# EAGLE design PCB-E21-KP01 (EAGLE 7.5.0)

## Sheet 1 of 2
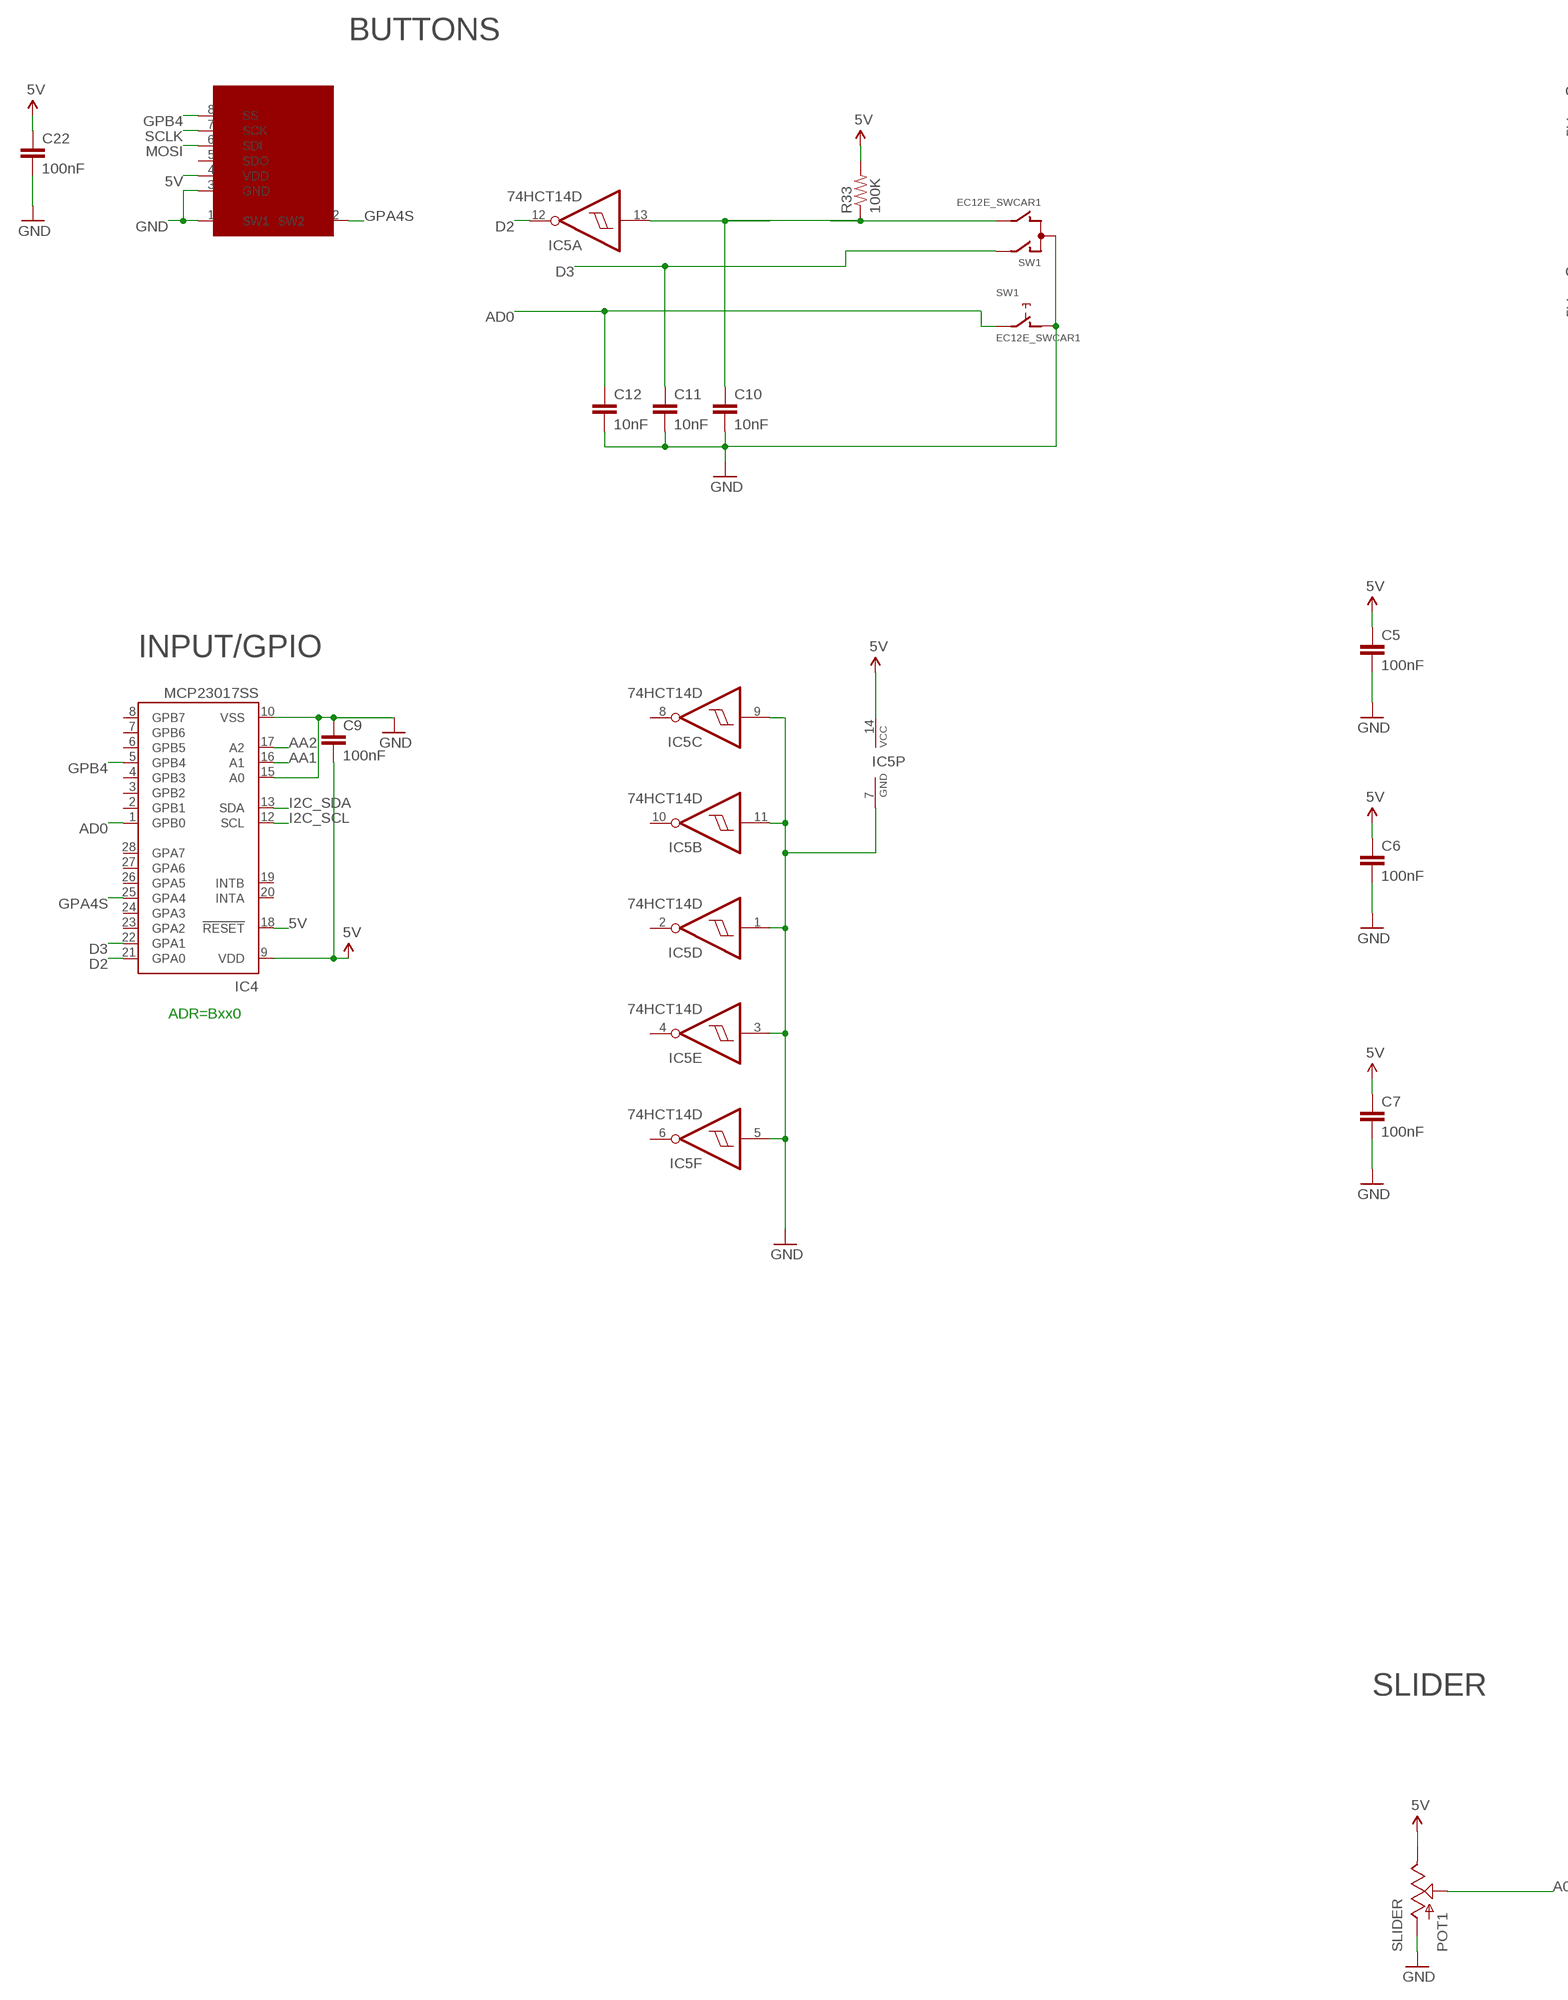
[diagram p0: schematic, sheet 1, part 1 of 2]
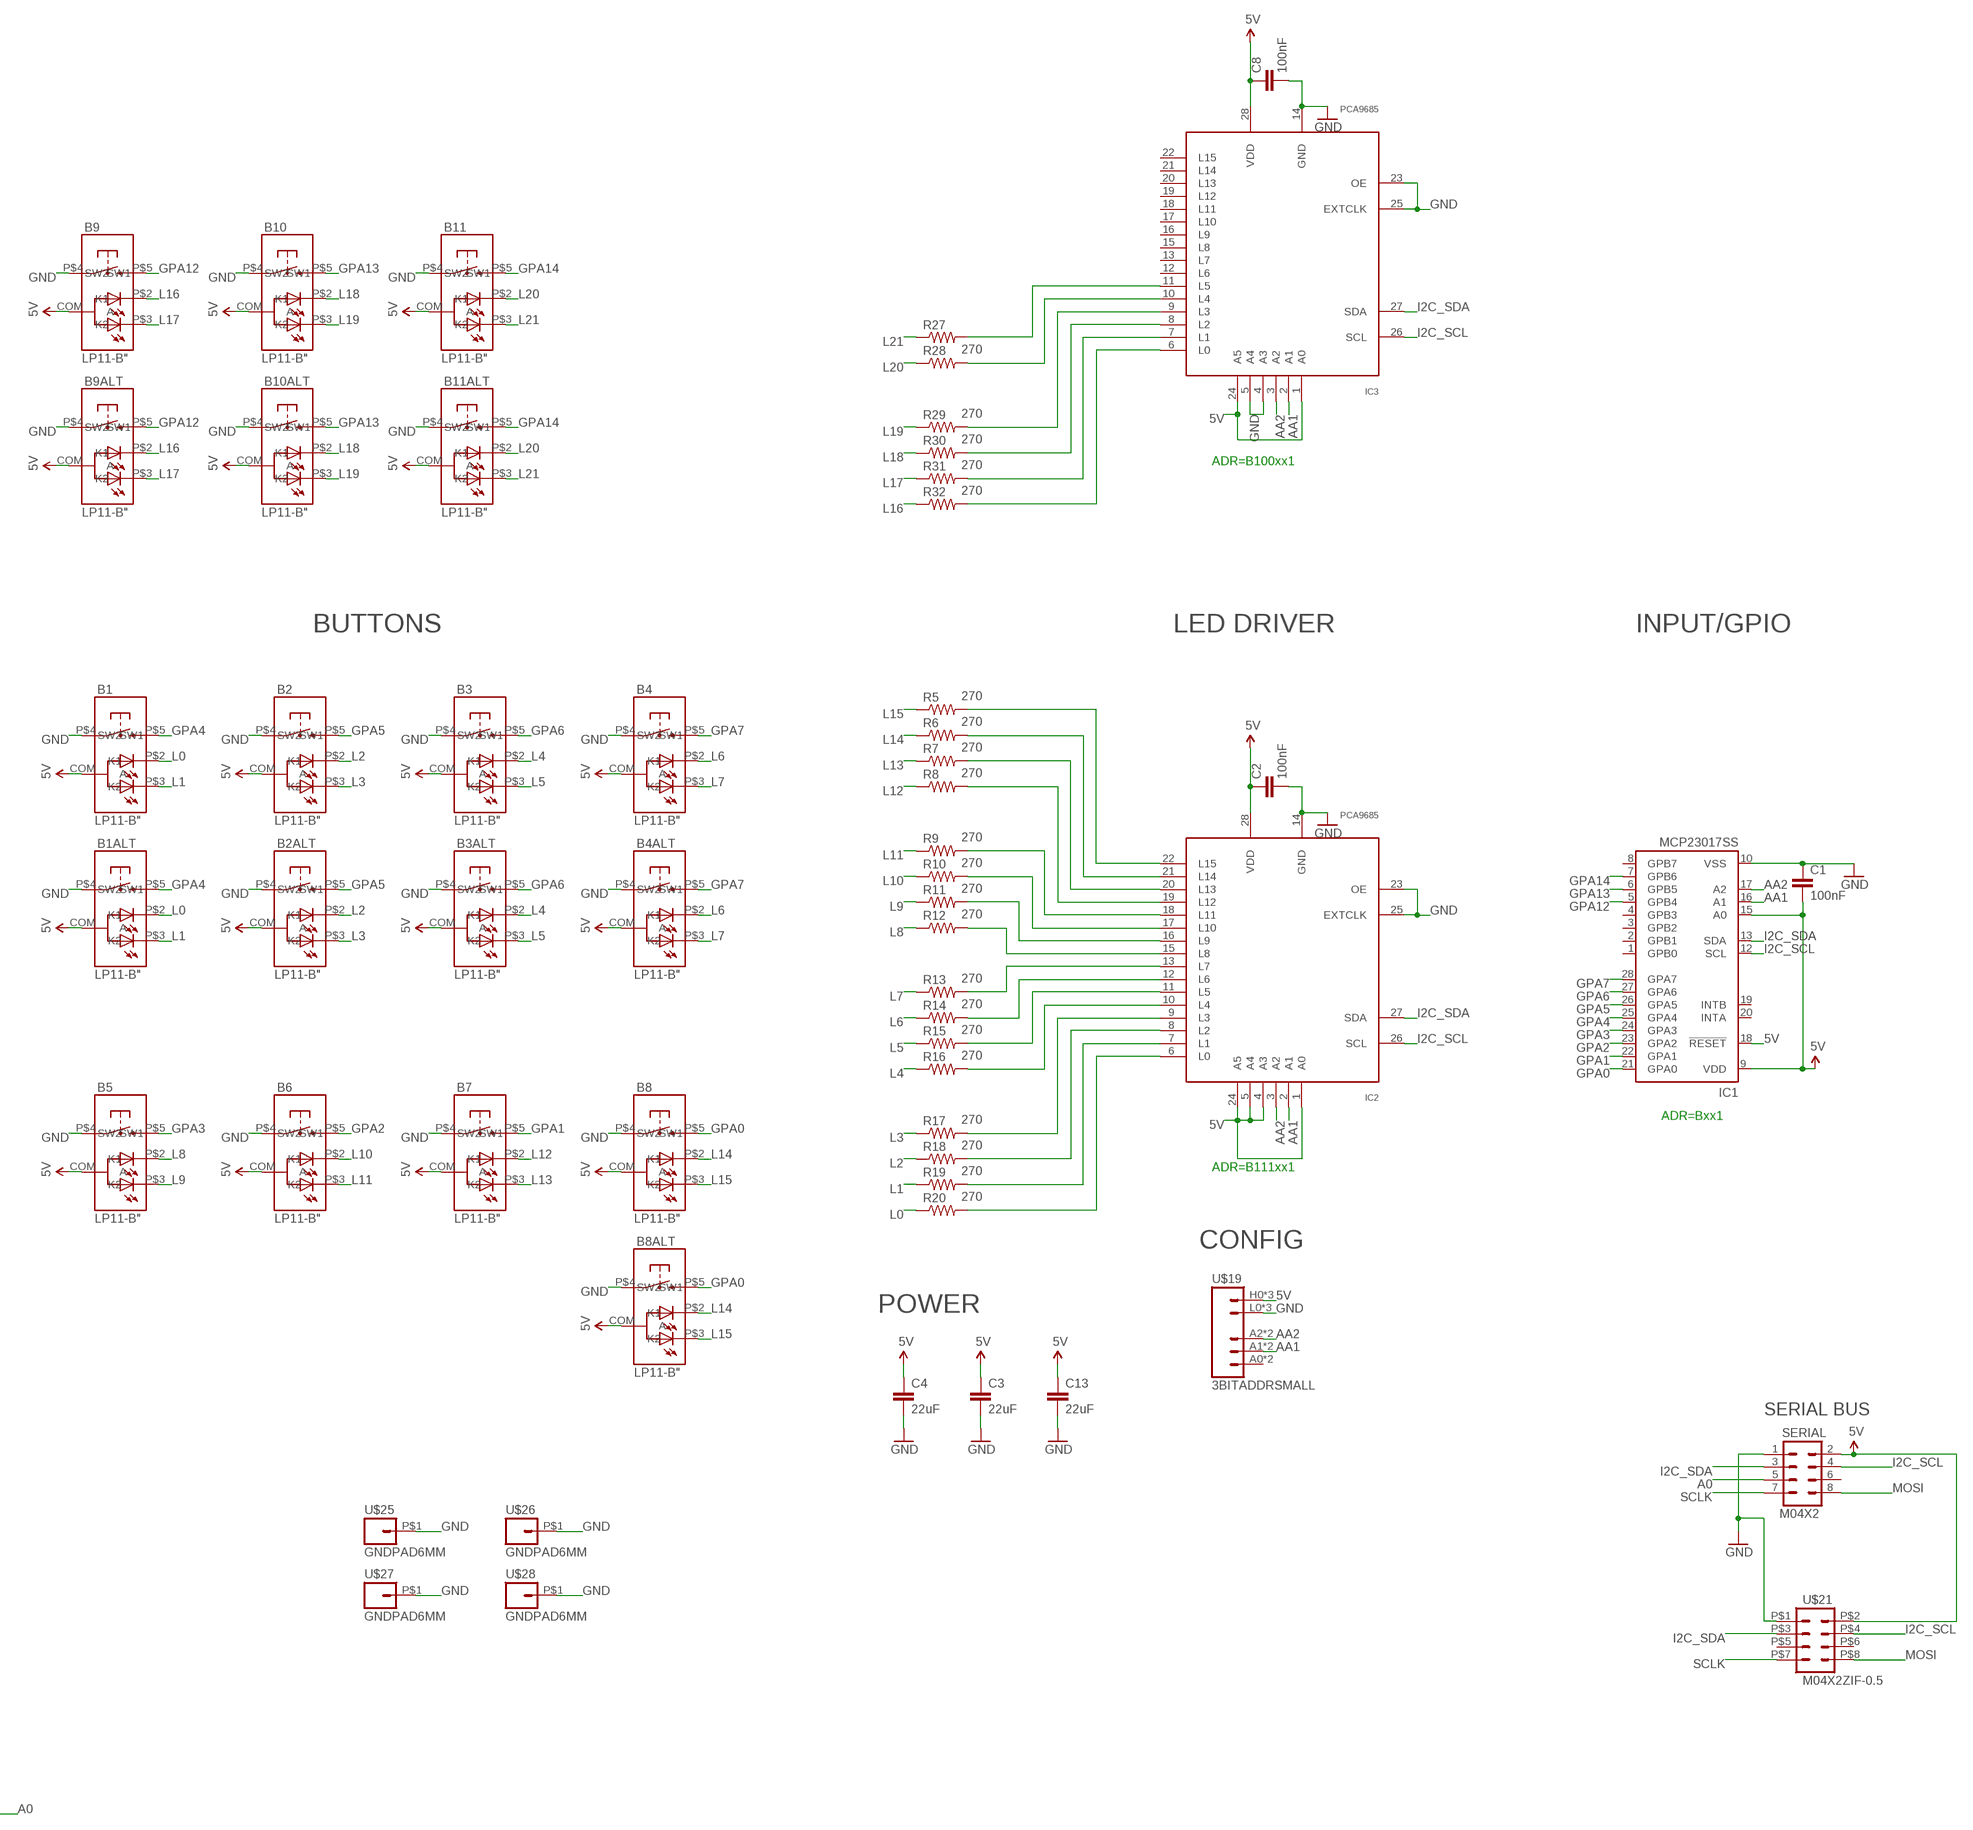
[diagram p1: schematic, sheet 1, part 2 of 2]

### Parts
B1  LP11-B"  [LP11]
B1ALT  LP11-B"  [LP11]
B2  LP11-B"  [LP11]
B2ALT  LP11-B"  [LP11]
B3  LP11-B"  [LP11]
B3ALT  LP11-B"  [LP11]
B4  LP11-B"  [LP11]
B4ALT  LP11-B"  [LP11]
B5  LP11-B"  [LP11]
B6  LP11-B"  [LP11]
B7  LP11-B"  [LP11]
B8  LP11-B"  [LP11]
B8ALT  LP11-B"  [LP11]
B9  LP11-B"  [LP11]
B9ALT  LP11-B"  [LP11]
B10  LP11-B"  [LP11]
B10ALT  LP11-B"  [LP11]
B11  LP11-B"  [LP11]
B11ALT  LP11-B"  [LP11]
C1  100nF  CAP0603-CAP  [0603-CAP]
C2  100nF  CAP0603-CAP  [0603-CAP]
C3  22uF  CAP0805  [0805]
C4  22uF  CAP0805  [0805]
C5  100nF  CAP0603-CAP  [0603-CAP]
C6  100nF  CAP0603-CAP  [0603-CAP]
C7  100nF  CAP0603-CAP  [0603-CAP]
C8  100nF  CAP0603-CAP  [0603-CAP]
C9  100nF  CAP0603-CAP  [0603-CAP]
C10  10nF  CAP0603-CAP  [0603-CAP]
C11  10nF  CAP0603-CAP  [0603-CAP]
C12  10nF  CAP0603-CAP  [0603-CAP]
C13  22uF  CAP0805  [0805]
C22  100nF  CAP0603-CAP  [0603-CAP]
IC1  MCP23017SS  [SSOP28]
IC2  PCA9685  [TSSOP28]
IC3  PCA9685  [TSSOP28]
IC4  MCP23017SS  [SSOP28]
IC5  74HCT14D  [SO14]
POT1  SLIDER  [SLIDER20-CAR1]
R5  270  RESISTOR0603-RES  [0603-RES]
R6  270  RESISTOR0603-RES  [0603-RES]
R7  270  RESISTOR0603-RES  [0603-RES]
R8  270  RESISTOR0603-RES  [0603-RES]
R9  270  RESISTOR0603-RES  [0603-RES]
R10  270  RESISTOR0603-RES  [0603-RES]
R11  270  RESISTOR0603-RES  [0603-RES]
R12  270  RESISTOR0603-RES  [0603-RES]
R13  270  RESISTOR0603-RES  [0603-RES]
R14  270  RESISTOR0603-RES  [0603-RES]
R15  270  RESISTOR0603-RES  [0603-RES]
R16  270  RESISTOR0603-RES  [0603-RES]
R17  270  RESISTOR0603-RES  [0603-RES]
R18  270  RESISTOR0603-RES  [0603-RES]
R19  270  RESISTOR0603-RES  [0603-RES]
R20  270  RESISTOR0603-RES  [0603-RES]
R27  270  RESISTOR0603-RES  [0603-RES]
R28  270  RESISTOR0603-RES  [0603-RES]
R29  270  RESISTOR0603-RES  [0603-RES]
R30  270  RESISTOR0603-RES  [0603-RES]
R31  270  RESISTOR0603-RES  [0603-RES]
R32  270  RESISTOR0603-RES  [0603-RES]
R33  100K  RESISTOR0603-RES  [0603-RES]
SERIAL  M04X2  [2X4]
SSW1  SMART_SWITCHSMART_SWITCH_8PIN  [SMART_SWITCH]
SW1  EC12E_SWCAR1  [ALPS_EC12E_SW-CAR1]
U$19  3BITADDRSMALL  [3BITADDR_SMALL]
U$21  M04X2ZIF-0.5  [ZIP-8-0.5]
U$25  GNDPAD6MM  [3.2MMPAD6MM]
U$26  GNDPAD6MM  [3.2MMPAD6MM]
U$27  GNDPAD6MM  [3.2MMPAD6MM]
U$28  GNDPAD6MM  [3.2MMPAD6MM]

### Nets
5V [Power]: B1.COM(A) B1ALT.COM(A) B2.COM(A) B2ALT.COM(A) B3.COM(A) B3ALT.COM(A) B4.COM(A) B4ALT.COM(A) B5.COM(A) B6.COM(A) B7.COM(A) B8.COM(A) B8ALT.COM(A) B9.COM(A) B9ALT.COM(A) B10.COM(A) B10ALT.COM(A) B11.COM(A) B11ALT.COM(A) C1.2 C2.1 C3.1 C4.1 C5.1 C6.1 C7.1 C8.1 C9.2 C13.1 C22.1 IC1.9(VDD) IC1.15(A0) IC1.18(!RESET) IC2.1(A0) IC2.4(A3) IC2.5(A4) IC2.24(A5) IC2.28(VDD) IC3.1(A0) IC3.24(A5) IC3.28(VDD) IC4.9(VDD) IC4.18(!RESET) IC5.14(P:VCC) POT1.1(E) R33.2 SERIAL.2 SSW1.4(VDD) U$19.H0(VCC) U$19.H1(VCC) U$19.H2(VCC) U$21.P$2
A0: POT1.2A(S) SERIAL.5
AA1: IC1.16(A1) IC2.2(A1) IC3.2(A1) IC4.16(A1) U$19.A1 U$19.AS1(A1)
AA2: IC1.17(A2) IC2.3(A2) IC3.3(A2) IC4.17(A2) U$19.A2 U$19.AS2(A2)
AD0: C12.1 IC4.1(GPB0) SW1.E
D2: IC4.21(GPA0) IC5.12(A:O)
D3: C11.1 IC4.22(GPA1) SW1.A
GND [Power]: B1.P$4(SW1) B1ALT.P$4(SW1) B2.P$4(SW1) B2ALT.P$4(SW1) B3.P$4(SW1) B3ALT.P$4(SW1) B4.P$4(SW1) B4ALT.P$4(SW1) B5.P$4(SW1) B6.P$4(SW1) B7.P$4(SW1) B8.P$4(SW1) B8ALT.P$4(SW1) B9.P$4(SW1) B9ALT.P$4(SW1) B10.P$4(SW1) B10ALT.P$4(SW1) B11.P$4(SW1) B11ALT.P$4(SW1) C1.1 C2.2 C3.2 C4.2 C5.2 C6.2 C7.2 C8.2 C9.1 C10.2 C11.2 C12.2 C13.2 C22.2 IC1.10(VSS) IC2.14(GND) IC2.23(OE) IC2.25(EXTCLK) IC3.4(A3) IC3.5(A4) IC3.14(GND) IC3.23(OE) IC3.25(EXTCLK) IC4.10(VSS) IC4.15(A0) IC5.1(D:I) IC5.3(E:I) IC5.5(F:I) IC5.7(P:GND) IC5.9(C:I) IC5.11(B:I) POT1.3(A) SERIAL.1 SSW1.1(SW1) SSW1.3(GND) SW1.C SW1.D U$19.L0(GND) U$19.L1(GND) U$19.L2(GND) U$21.P$1 U$25.P$1 U$26.P$1 U$27.P$1 U$28.P$1
GPA0: B8.P$5(SW2) B8ALT.P$5(SW2) IC1.21(GPA0)
GPA1: B7.P$5(SW2) IC1.22(GPA1)
GPA2: B6.P$5(SW2) IC1.23(GPA2)
GPA3: B5.P$5(SW2) IC1.24(GPA3)
GPA4: B1.P$5(SW2) B1ALT.P$5(SW2) IC1.25(GPA4)
GPA4S: IC4.25(GPA4) SSW1.2(SW2)
GPA5: B2.P$5(SW2) B2ALT.P$5(SW2) IC1.26(GPA5)
GPA6: B3.P$5(SW2) B3ALT.P$5(SW2) IC1.27(GPA6)
GPA7: B4.P$5(SW2) B4ALT.P$5(SW2) IC1.28(GPA7)
GPA12: B9.P$5(SW2) B9ALT.P$5(SW2) IC1.5(GPB4)
GPA13: B10.P$5(SW2) B10ALT.P$5(SW2) IC1.6(GPB5)
GPA14: B11.P$5(SW2) B11ALT.P$5(SW2) IC1.7(GPB6)
GPB4: IC4.5(GPB4) SSW1.8(SS)
I2C_SCL: IC1.12(SCL) IC2.26(SCL) IC3.26(SCL) IC4.12(SCL) SERIAL.4 U$21.P$4
I2C_SDA: IC1.13(SDA) IC2.27(SDA) IC3.27(SDA) IC4.13(SDA) SERIAL.3 U$21.P$3
L0: B1.P$2(K1) B1ALT.P$2(K1) R20.1
L1: B1.P$3(K2) B1ALT.P$3(K2) R19.1
L2: B2.P$2(K1) B2ALT.P$2(K1) R18.1
L3: B2.P$3(K2) B2ALT.P$3(K2) R17.1
L4: B3.P$2(K1) B3ALT.P$2(K1) R16.1
L5: B3.P$3(K2) B3ALT.P$3(K2) R15.1
L6: B4.P$2(K1) B4ALT.P$2(K1) R14.1
L7: B4.P$3(K2) B4ALT.P$3(K2) R13.1
L8: B5.P$2(K1) R12.1
L9: B5.P$3(K2) R11.1
L10: B6.P$2(K1) R10.1
L11: B6.P$3(K2) R9.1
L12: B7.P$2(K1) R8.1
L13: B7.P$3(K2) R7.1
L14: B8.P$2(K1) B8ALT.P$2(K1) R6.1
L15: B8.P$3(K2) B8ALT.P$3(K2) R5.1
L16: B9.P$2(K1) B9ALT.P$2(K1) R32.1
L17: B9.P$3(K2) B9ALT.P$3(K2) R31.1
L18: B10.P$2(K1) B10ALT.P$2(K1) R30.1
L19: B10.P$3(K2) B10ALT.P$3(K2) R29.1
L20: B11.P$2(K1) B11ALT.P$2(K1) R28.1
L21: B11.P$3(K2) B11ALT.P$3(K2) R27.1
MOSI: SERIAL.8 SSW1.6(SDI) U$21.P$8
N$3: IC3.11(L5) R27.2
N$4: IC2.13(L7) R13.2
N$5: IC2.12(L6) R14.2
N$6: IC3.10(L4) R28.2
N$7: IC2.11(L5) R15.2
N$8: IC3.9(L3) R29.2
N$9: IC2.10(L4) R16.2
N$10: IC2.9(L3) R17.2
N$11: IC2.8(L2) R18.2
N$12: IC2.7(L1) R19.2
N$13: IC3.8(L2) R30.2
N$14: IC3.7(L1) R31.2
N$15: IC3.6(L0) R32.2
N$19: IC2.6(L0) R20.2
N$20: IC2.15(L8) R12.2
N$21: IC2.16(L9) R11.2
N$22: IC2.17(L10) R10.2
N$23: IC2.18(L11) R9.2
N$24: IC2.19(L12) R8.2
N$25: IC2.20(L13) R7.2
N$26: IC2.21(L14) R6.2
N$27: IC2.22(L15) R5.2
N$33: C10.1 IC5.13(A:I) R33.1 SW1.B
SCLK: SERIAL.7 SSW1.7(SCK) U$21.P$7
Unconnected: IC1.1(GPB0) IC1.2(GPB1) IC1.3(GPB2) IC1.4(GPB3) IC1.8(GPB7) IC1.19(INTB) IC1.20(INTA) IC3.12(L6) IC3.13(L7) IC3.15(L8) IC3.16(L9) IC3.17(L10) IC3.18(L11) IC3.19(L12) IC3.20(L13) IC3.21(L14) IC3.22(L15) IC4.2(GPB1) IC4.3(GPB2) IC4.4(GPB3) IC4.6(GPB5) IC4.7(GPB6) IC4.8(GPB7) IC4.19(INTB) IC4.20(INTA) IC4.23(GPA2) IC4.24(GPA3) IC4.26(GPA5) IC4.27(GPA6) IC4.28(GPA7) IC5.2(D:O) IC5.4(E:O) IC5.6(F:O) IC5.8(C:O) IC5.10(B:O) SERIAL.6 SSW1.5(SDO) SW1.GND1(G) SW1.GND2(G) U$19.A0 U$19.AS0(A0) U$21.P$5 U$21.P$6

### Notes on the sheet
- BUTTONS
- ADR=B100xx1
- BUTTONS | LED DRIVER | INPUT/GPIO
- INPUT/GPIO
- ADR=Bxx0
- ADR=Bxx1
- ADR=B111xx1
- CONFIG
- POWER
- SERIAL BUS
- SLIDER

## Sheet 2 of 2

## Library data of the parts
B1 B1ALT B2 B2ALT B3 B3ALT B4 B4ALT B5-B8 B8ALT B9 B9ALT B10 B10ALT B11 B11ALT = SKAARHOJ:LP11-B
C1-C13 C22 = SparkFun:CAP: Capacitor Standard 0603 ceramic capacitor, and 0.1" leaded capacitor.
IC1 IC4 = microchip:MCP23017: http://ww1.microchip.com/downloads/en/DeviceDoc/21952a.pdf Source: http://ww1.microchip.com/downloads/en/DeviceDoc/21952a.pdf; MF: MICROCHIP; MPN: MCP23017-E/SS; OC_FARNELL: 1467674; OC_NEWARK: 31K2960
IC2 IC3 = wsmith:PCA9685
IC5 = 74xx-eu:74*14: Hex schmitt trigger INVERTER
POT1 = SKAARHOJ:SLIDER
R5-R20 R27-R33 = SparkFun:RESISTOR: Resistor Basic schematic elements and footprints for 0603, 1206, and PTH resistors.
SERIAL = SparkFun:M04X2
SSW1 = SKAARHOJ:SMART_SWITCH: SMARTSWITCH IS15DSBFP4RGB www.nkksmartswitch.com
SW1 = SKAARHOJ:EC12E_SW: ALPS rotary Encoder EC12E series with switch
U$19 = SKAARHOJ:3BITADDR
U$21 = SKAARHOJ:M04X2
U$25-U$28 = SKAARHOJ:GNDPAD

## Net classes
0 default: width 0.203 mm, drill 0.406 mm, clearance 0.203 mm
1 Power: width 0.406 mm, drill 0.61 mm, clearance 0.203 mm

## Board
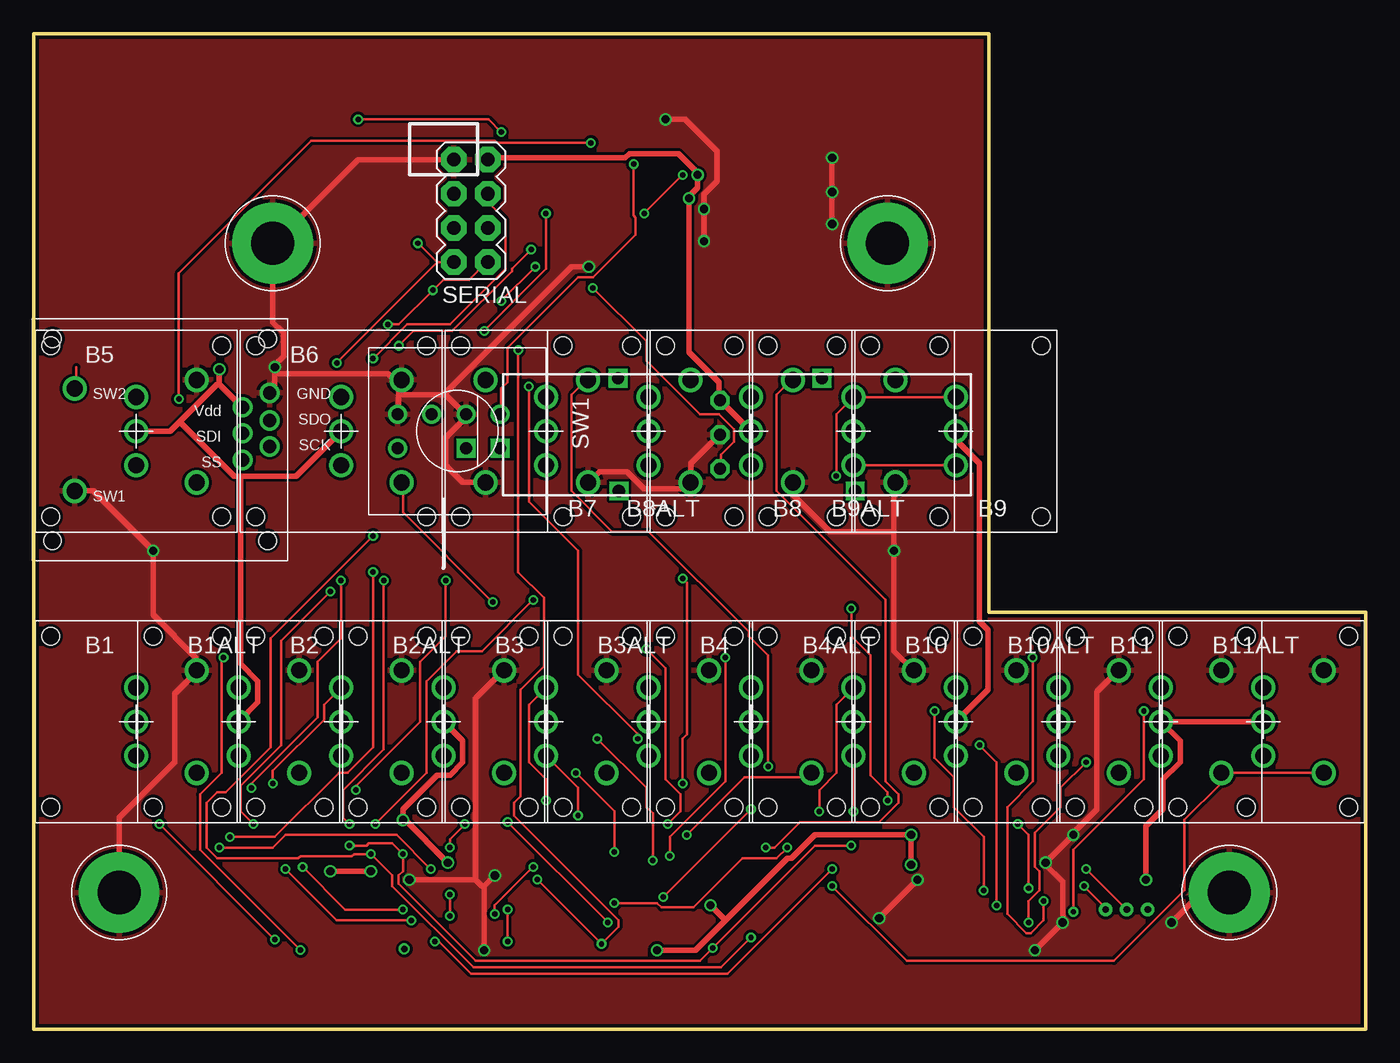
[diagram p2: board, top side]
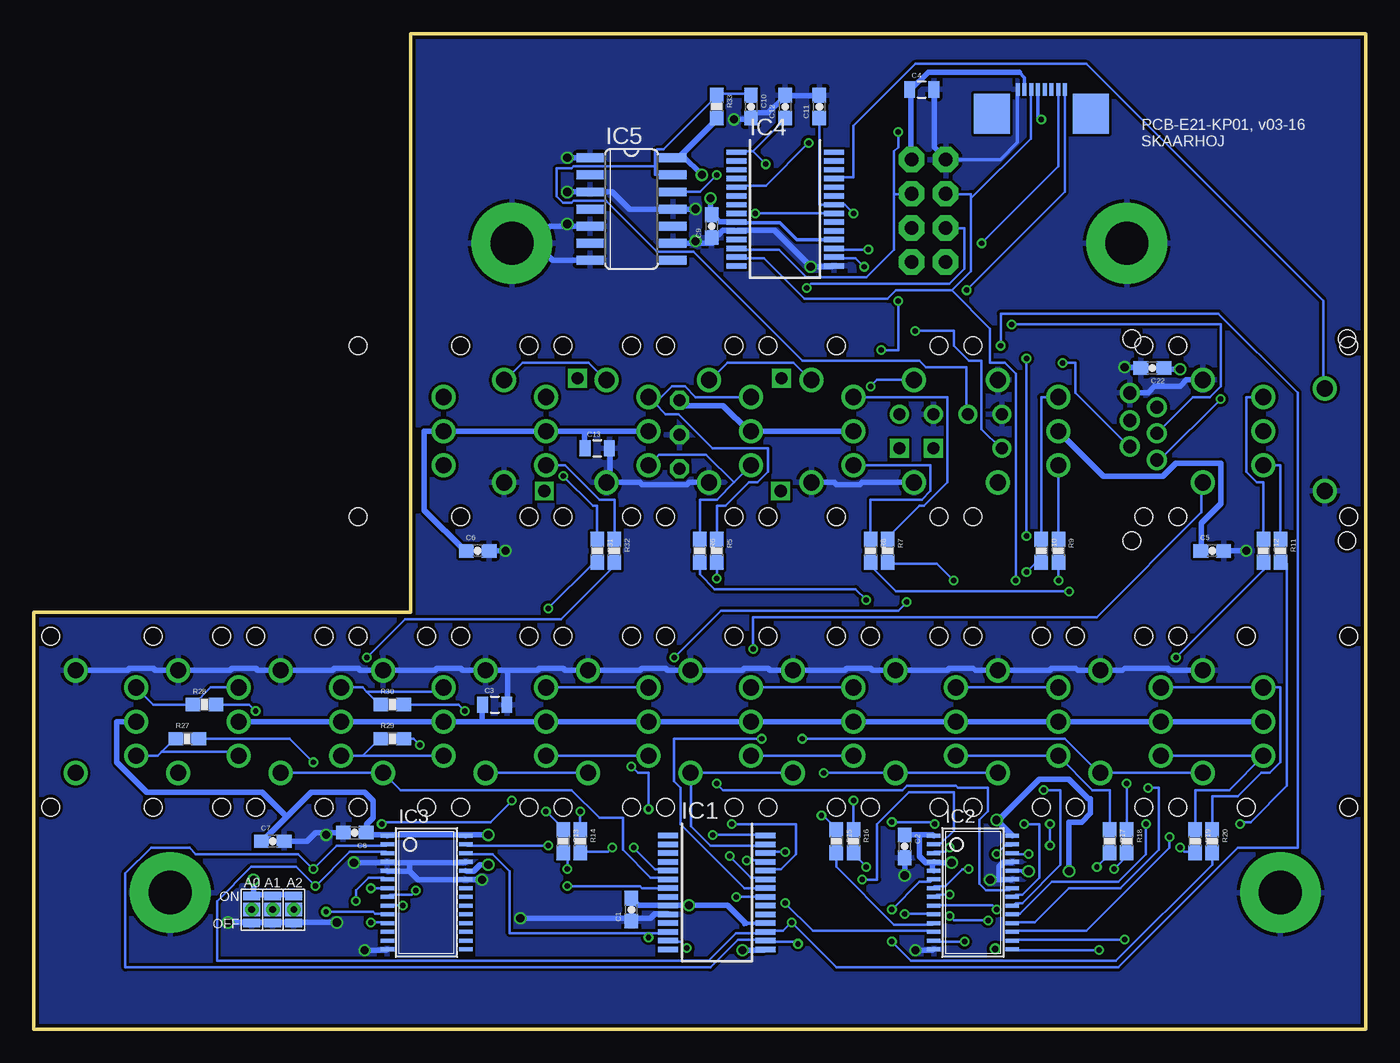
[diagram p3: board, bottom side, seen from below]

Size 99.06 x 74 mm. Coordinates in mm from the lower left corner, seen from the top.
Outline: 0,74 0,0 99.06,0 99.06,31 71.03,31 71.03,74 0,74
Copper layers (1*16): Top 0.035mm / dielectric 1.5mm / Bottom 0.035mm
Design rules "Fusion_eagle_rule_v1.1": minimum track width 6mil, minimum drill 12mil, track to track 6mil, track to pad 6mil, pad to pad 6mil, via to via 6mil, smd to smd 0mil, copper to edge 10mil, drill to drill 10mil, minimum pad ring 10mil, minimum via ring 6mil, stop-mask expansion 2mil, vias tented up to drill 100mil, thermal gap 10mil

### Footprints (pad centres in the part's own frame; a part is rotated, then mirrored left to right if it is on the bottom)
LP11 = drill 1.2: COM 0,0; P$2 0,2.54; P$3 0,-2.54; P$4 4.5,3.81; P$5 4.5,-3.81 | hole 1.3: -6.35,6.35; 6.35,6.35; 6.35,-6.35; -6.35,-6.35
0603-CAP = smd 1.1 x 1: 1 -0.85,0; 2 0.85,0
0805 = smd 0.8 x 1.2: 1 -0.9,0; 2 0.9,0
SSOP28 = smd 0.4 x 1.5: 1 -4.225,-3.625; 2 -3.575,-3.625; 3 -2.925,-3.625; 4 -2.275,-3.625; 5 -1.625,-3.625; 6 -0.975,-3.625; 7 -0.325,-3.625; 8 0.325,-3.625; 9 0.975,-3.625; 10 1.625,-3.625; 11 2.275,-3.625; 12 2.925,-3.625; 13 3.575,-3.625; 14 4.225,-3.625; 15 4.225,3.625; 16 3.575,3.625; 17 2.925,3.625; 18 2.275,3.625; 19 1.625,3.625; 20 0.975,3.625; 21 0.325,3.625; 22 -0.325,3.625; 23 -0.975,3.625; 24 -1.625,3.625; 25 -2.275,3.625; 26 -2.925,3.625; 27 -3.575,3.625; 28 -4.225,3.625
TSSOP28 = smd 0.305 x 0.991: 1 -4.225,-2.918; 2 -3.575,-2.918; 3 -2.925,-2.918; 4 -2.275,-2.918; 5 -1.625,-2.918; 6 -0.975,-2.918; 7 -0.325,-2.918; 8 0.325,-2.918; 9 0.975,-2.918; 10 1.625,-2.918; 11 2.275,-2.918; 12 2.925,-2.918; 13 3.575,-2.918; 14 4.225,-2.918; 15 4.225,2.918; 16 3.575,2.918; 17 2.925,2.918; 18 2.275,2.918; 19 1.625,2.918; 20 0.975,2.918; 21 0.325,2.918; 22 -0.325,2.918; 23 -0.975,2.918; 24 -1.625,2.918; 25 -2.275,2.918; 26 -2.925,2.918; 27 -3.575,2.918; 28 -4.225,2.918
SO14 = smd 0.66 x 2.032: 1 -3.81,-3.073; 2 -2.54,-3.073; 3 -1.27,-3.073; 4 0,-3.073; 5 1.27,-3.073; 6 2.54,-3.073; 7 3.81,-3.073; 8 3.81,3.073; 9 2.54,3.073; 10 1.27,3.073; 11 0,3.073; 12 -1.27,3.073; 13 -2.54,3.073; 14 -3.81,3.073
SLIDER20-CAR1 = drill 0.9 octagon: 1 -1.27,2.54; 2A -1.27,-2.54; 3 -1.27,0 | drill 0.9 square: P$1 -8.852,4.191; P$2 6.312,4.191; P$3 8.788,-4.191; P$4 -8.788,-4.191
0603-RES = smd 1.1 x 1: 1 -0.85,0; 2 0.85,0
2X4 = drill 1.016 pad 1.88 octagon: 1 -3.81,-1.27; 2 -3.81,1.27; 3 -1.27,-1.27; 4 -1.27,1.27; 5 1.27,-1.27; 6 1.27,1.27; 7 3.81,-1.27; 8 3.81,1.27
SMART_SWITCH = drill 1.2: 1 6.35,3.81; 2 6.35,-3.81 | drill 1: 3 -8.153,-3.48; 4 -6.147,-2.413; 5 -8.153,-1.422; 6 -6.147,-0.483; 7 -8.153,0.508; 8 -6.147,1.499 | hole 1.3: -8.001,7.506; 8.001,7.506; 8.001,-7.506; -8.001,-7.506
ALPS_EC12E_SW-CAR1 = drill 0.9: A 1.27,-4.445; B -1.27,-1.905; C -1.27,-4.445; D -1.27,0.635; E -1.27,3.175 | drill 0.9 square: GND1 1.27,3.175; GND2 1.27,0.635
3BITADDR_SMALL = drill 0.5: A0 -1.565,0; A1 0,0; A2 1.565,0 | smd 1.27 x 1: AS0 -1.565,0; AS1 0,0; AS2 1.565,0 | smd 1.27 x 0.635: H0 -1.565,1; H1 0,1; H2 1.565,1; L0 -1.565,-1; L1 0,-1; L2 1.565,-1
ZIP-8-0.5 = smd 2.7 x 3: GND$1 3.68,-1.8; GND$9 -3.68,-1.8 | smd 0.3 x 0.96: P$1 -1.75,0; P$2 -1.25,0; P$3 -0.75,0; P$4 -0.25,0; P$5 0.25,0; P$6 0.75,0; P$7 1.25,0; P$8 1.75,0
3.2MMPAD6MM = drill 3.2 pad 6: P$1 0,0

### Placement (x,y rotation side)
B1  7.62,22.86 0 top
B1ALT  15.24,22.86 0 top
B2  22.86,22.86 0 top
B2ALT  30.48,22.86 0 top
B3  38.1,22.86 0 top
B3ALT  45.72,22.86 0 top
B4  53.34,22.86 0 top
B4ALT  60.96,22.86 0 top
B5  7.62,44.45 0 top
B6  22.86,44.45 0 top
B7  38.1,44.45 180 top
B8  53.34,44.45 180 top
B8ALT  45.72,44.45 180 top
B9  68.58,44.45 180 top
B9ALT  60.96,44.45 180 top
B10  68.58,22.86 0 top
B10ALT  76.2,22.86 0 top
B11  83.82,22.86 0 top
B11ALT  91.44,22.86 0 top
C1  54.61,8.89 90 bottom
C2  34.29,13.59 270 bottom
C3  64.77,24.13 0 bottom
C4  33.02,69.85 0 bottom
C5  11.43,35.56 0 bottom
C6  66.04,35.56 0 bottom
C7  81.28,13.97 0 bottom
C8  75.18,14.61 180 bottom
C9  48.64,59.69 90 bottom
C10  45.72,68.58 270 bottom
C11  40.64,68.58 90 bottom
C12  43.18,68.58 90 bottom
C13  57.15,43.18 0 bottom
C22  15.88,49.15 180 bottom
IC1  48.26,10.16 270 bottom
IC2  29.21,10.16 270 bottom
IC3  69.85,10.16 270 bottom
IC4  43.18,60.96 270 bottom
IC5  54.61,60.96 270 bottom
POT1  52.3,44.2 0 top
R5  48.26,35.56 270 bottom
R6  49.53,35.56 270 bottom
R7  35.56,35.56 270 bottom
R8  36.83,35.56 270 bottom
R9  22.86,35.56 270 bottom
R10  24.13,35.56 270 bottom
R11  6.35,35.56 270 bottom
R12  7.62,35.56 270 bottom
R13  59.69,13.97 270 bottom
R14  58.42,13.97 270 bottom
R15  39.37,13.97 270 bottom
R16  38.1,13.97 270 bottom
R17  19.05,13.97 270 bottom
R18  17.78,13.97 270 bottom
R19  12.7,13.97 270 bottom
R20  11.43,13.97 270 bottom
R27  87.63,21.59 0 bottom
R28  86.36,24.13 0 bottom
R29  72.39,21.59 0 bottom
R30  72.39,24.13 0 bottom
R31  57.15,35.56 270 bottom
R32  55.88,35.56 270 bottom
R33  48.26,68.58 270 bottom
SERIAL  32.51,60.83 270 top
SSW1  9.4,43.81 180 top
SW1  31.51,44.45 270 top
U$19  81.28,8.89 0 bottom
U$21  24.13,69.85 0 bottom
U$25  6.35,10.16 0 top
U$26  88.9,10.16 0 top
U$27  63.5,58.42 0 top
U$28  17.78,58.42 0 top

### Tracks (layer width: path | path; a pad name or v marks a point on that pad's centre or on a via)
5V  (via drill 0.61)
  Top 0.406: B8.COM 51.12,46.67 POT1.1 50.96,46.83 50.96,48.1 48.74,50.32 v48.74,61.75 48.74,61.91 49.37,62.55 v49.37,63.5 49.37,63.66 47.94,65.09 44.29,65.09 43.97,64.77 33.81,64.77 SERIAL.2 | v65.25,12.22 v65.25,14.45 58.1,14.45 56.36,12.7 56.04,12.7 51.44,8.1 | v46.35,5.87 49.21,5.87 51.44,8.1 | 51.44,8.1 v50.32,9.21 | 13.81,47.94 v13.81,49.05 | 13.81,47.94 15.4,46.35 SSW1.4 | 10.87,45.16 10.16,44.45 B5.COM | 10.87,45.16 13.65,47.94 13.81,47.94 | 10.87,45.16 14.92,41.12 15.4,41.12 | 15.4,41.12 19.53,41.12 B6.COM | v82.71,11.11 82.71,15.08 83.98,16.35 83.98,18.57 85.25,19.84 85.25,21.43 B11.COM B11ALT.COM | B2ALT.COM 31.91,21.43 31.91,19.84 30.96,18.89 30,18.89 27.46,16.35 v27.46,15.56 27.62,15.56 v30.8,12.38 | 15.4,41.12 15.4,27.15 16.67,25.88 16.67,24.29 B1ALT.COM | B9.COM 68.58,43.81 70.33,42.07 70.33,30.32 70.96,29.69 70.96,25.24 B10.COM | v22.07,11.75 v25.08,11.75
  Bottom 0.254: IC4.18 42.3,58.69 43.56,59.94 46.76,59.94 IC4.9 | IC1.18 46.09,7.88 46.23,7.75 | IC2.24 25.5,11.79 25.43,11.72 25.4,11.68 | U$21.P$2 25.4,69.87 25.4,70.74 25.78,71.12
  Bottom 0.406: C6.1 66.99,35.56 70.01,38.58 70.01,44.45 B9.COM B9ALT.COM 58.1,44.45 | B7.COM B8ALT.COM 45.88,44.45 47.78,46.35 50.64,46.35 50.96,46.67 POT1.1 | R33.2 48.26,67.63 51.12,64.77 IC5.14 50.8,64.93 v49.37,63.5 | IC4.9 46.83,60.01 48.1,60.01 48.58,60.48 C9.2 48.74,60.64 v48.74,61.75 | B8.COM 58.1,44.45 | 80.25,15.8 78.42,17.62 74.45,17.62 73.82,16.99 73.82,15.72 74.3,15.24 74.3,14.76 C8.1 74.3,14.61 74.14,14.45 72.87,14.45 IC3.1 72.71,14.45 66.99,14.45 IC3.28 66.83,14.45 v65.25,14.45 | 80.25,15.8 82.07,13.97 C7.1 | C1.2 54.61,9.68 54.13,9.21 51.91,9.21 IC1.9 51.75,9.21 v50.32,9.21 47.47,9.21 46.2,7.94 46.09,7.88 | v65.25,12.22 65.88,12.22 66.36,11.75 66.83,11.75 IC3.24 | v46.35,5.87 44.77,5.87 IC1.15 | v13.81,49.05 14.92,49.05 C22.1 | B6.COM 19.53,41.12 15.08,41.12 14.13,42.07 10.79,42.07 10.79,39.05 12.22,37.62 12.22,35.56 C5.1 | U$19.H2 79.85,10 81.28,10 U$19.H1 81.44,10 82.71,10 U$19.H0 82.71,10.16 v82.71,11.11 | B1.COM B1ALT.COM B2.COM B2ALT.COM B3.COM B3ALT.COM B4.COM B4ALT.COM 65.72,22.86 | IC2.5 32.23,11.91 32.23,12.38 IC2.4 | 33.18,14.45 C2.1 | 33.18,14.45 32.23,14.45 IC2.1 | 33.18,14.45 33.18,12.86 32.7,12.38 32.38,12.38 IC2.4 | IC2.28 26.35,14.45 v27.46,15.56 27.3,15.56 24.29,18.57 22.07,18.57 20.64,17.14 20.48,17.14 20.48,16.03 21.11,15.4 22.07,15.4 v22.07,11.75 | v30.8,12.38 32.07,12.38 IC2.4 | 65.72,22.86 B10.COM B10ALT.COM B11.COM | 80.25,15.8 82.07,17.62 90.65,17.62 92.87,19.84 92.87,22.86 B11ALT.COM | v25.08,11.75 25.4,11.75 25.43,11.72 | 25.78,71.12 32.54,71.12 33.81,69.85 C4.1 33.81,69.69 33.81,64.77 SERIAL.2 | 65.72,22.86 65.72,24.13 C3.1
  Bottom 0.406: 58.1,44.45 58.1,43.18 C13.1
A0  (via drill 0.41)
  Top 0.203: v41.59,55.09 45.56,51.12 45.56,49.69 49.53,45.72 50.96,45.72 52.07,44.61 52.07,43.66 51.12,42.7 51.12,41.75 POT1.2A
  Bottom 0.203: v41.59,55.09 41.27,55.4 30.96,55.4 29.84,56.52 29.84,59.53 31.11,59.53 SERIAL.5
AA1  (via drill 0.41)
  Top 0.203: U$19.AS1 v78.26,11.91 | v37.47,11.11 v42.23,6.35 43.5,7.62 43.5,8.1 35.72,15.88 35.72,16.83 36.2,17.3 36.2,25.24 37.94,26.99 37.94,32.07 36.04,33.97 v36.04,50.48 | v34.77,54.13 v37.31,56.67
  Bottom 0.203: IC3.2 72.87,13.65 76.52,13.65 v78.26,11.91 79.38,13.02 87,13.02 87.47,13.49 90.33,13.49 92.23,11.59 92.23,4.6 48.74,4.6 46.67,6.67 44.77,6.67 IC1.16 44.61,6.51 42.39,6.51 v42.23,6.35 | v37.47,11.11 36.35,11.11 36.35,15.24 33.97,17.62 30.64,17.62 30.64,14.76 31.59,13.81 32.07,13.81 IC2.2 | v37.31,56.67 37.94,57.31 39.53,57.31 IC4.16 | v34.77,54.13 34.77,50.48 v36.04,50.48
AA2  (via drill 0.41)
  Top 0.203: v78.11,10.64 79.85,8.89 U$19.AS2 | v30.96,13.49 30.96,14.13 v32.07,15.24 | v42.7,7.94 v35.24,15.4 | v36.99,57.94 35.56,56.52 35.56,56.36 31.11,51.91 28.26,51.91 v27.15,50.8
  Bottom 0.203: IC3.3 72.87,13.18 75.56,13.18 v78.11,10.64 79.53,12.06 82.87,12.06 85.41,9.53 85.41,5.08 48.9,5.08 46.83,7.14 44.77,7.14 IC1.17 44.61,7.3 43.34,7.3 v42.7,7.94 39.37,4.6 18.41,4.6 9.53,13.49 5.08,13.49 5.08,47.31 10.95,53.18 27.15,53.18 v27.15,50.8 | 79.85,8.89 U$19.AS2 | v30.96,13.49 31.27,13.18 32.07,13.18 IC2.3 | v32.07,15.24 32.23,15.4 v35.24,15.4 | v36.99,57.94 39.53,57.94 IC4.17
AD0  (via drill 0.41)
  Top 0.203: v44.61,64.29 44.61,60.48 44.77,60.33 44.77,59.05 41.59,55.88 40.48,55.88 35.24,50.64 35.24,48.1 34.77,47.62 34.77,45.72 SW1.E
  Bottom 0.203: 45.56,65.25 43.18,67.63 C12.1 | 45.56,65.25 46.67,65.25 IC4.1 | 45.56,65.25 v44.61,64.29
D2  (via drill 0.41)
  Top 0.203: v48.26,63.5 v45.4,60.64
  Bottom 0.203: v45.4,60.64 39.69,60.64 IC4.21 | v48.26,63.5 49.53,62.23 IC5.12
D3  (via drill 0.41)
  Top 0.203: v33.5,51.91 38.1,56.52 v38.1,60.64
  Bottom 0.203: C11.1 40.64,61.28 39.69,61.28 IC4.22 39.53,61.28 38.73,61.28 v38.1,60.64 | v33.5,51.91 30.64,51.91 30.64,50.8 29.53,49.69 28.57,49.69 28.57,44.61 27.15,43.18 SW1.A
GND  (via drill 0.61)
  Top 0.406: v49.85,58.58 v49.85,60.96 49.85,62.07 50.8,63.02 50.8,65.25 48.42,67.63 v46.99,67.63 | v59.37,59.85 v59.37,62.23 v59.37,64.77 | v74.45,5.87 v76.52,7.94 76.52,10.95 75.25,12.22 v75.25,12.38 v77.31,14.45 77.31,14.61 79.06,16.35 79.06,25.08 80.64,26.67 B10ALT.P$4 | v65.72,11.11 v62.87,8.26 | U$26.P$1 86.84,10.16 v84.61,7.94 | 17.94,48.74 17.94,47.62 17.62,47.31 SSW1.3 | 17.94,48.74 v17.94,49.21 17.94,49.37 18.57,50.01 18.57,51.75 17.78,52.55 U$28.P$1 17.94,58.42 24.13,64.61 31.11,64.61 SERIAL.1 | 27.15,47.15 27.15,48.1 27.3,48.26 B6.P$4 26.99,48.1 26.35,48.74 17.94,48.74 | 27.15,47.15 27.15,45.72 SW1.C | 30.64,47.15 32.07,45.72 SW1.D 32.23,45.56 30.64,43.97 30.64,41.91 31.91,40.64 B7.P$4 | 27.15,47.15 30.64,47.15 | POT1.3 50.96,44.13 48.9,42.07 48.9,40.64 B8.P$4 48.74,40.48 48.42,40.16 45.4,40.16 44.13,41.43 42.07,41.43 41.27,40.64 B8ALT.P$4 | SSW1.1 4.45,40.01 v8.89,35.56 8.89,30.8 12.06,27.62 12.06,26.67 B1.P$4 12.06,26.51 10.48,24.92 10.48,19.84 6.35,15.72 U$25.P$1 | 33.5,10.64 v33.5,5.87 | v34.29,11.43 33.5,10.64 | 32.86,11.11 v27.94,11.11 | 32.86,11.11 33.34,10.64 33.5,10.64 | 63.98,36.99 63.98,40.64 B9.P$4 | 63.98,36.99 v63.98,35.56 63.98,28.1 65.41,26.67 B4ALT.P$4 | 32.86,11.11 32.86,24.61 34.92,26.67 B2ALT.P$4 | 63.98,36.99 59.21,36.99 56.52,39.69 56.52,40.64 B9ALT.P$4 | v41.27,56.67 40.01,56.67 30.64,47.31 30.64,47.15
  Bottom 0.254: U$21.P$1 25.91,69.82 25.91,65.91 27.18,64.64 SERIAL.1
  Bottom 0.406: 40.48,69.37 C11.2 40.64,69.37 43.18,69.37 C12.2 43.02,69.22 43.18,69.06 43.5,69.06 44.45,68.1 45.72,68.1 C10.2 45.88,67.63 v46.99,67.63 | IC5.9 49.85,58.42 | 49.85,58.42 48.58,58.42 48.58,58.74 C9.1 48.58,58.9 48.58,59.05 48.1,59.05 47.78,59.37 46.99,59.37 IC4.10 | v49.85,60.96 IC5.11 54.77,60.96 56.04,62.23 IC5.3 v59.37,62.23 | v49.85,58.58 49.85,58.42 | IC4.15 39.69,56.67 v41.27,56.67 43.97,59.37 46.51,59.37 IC4.10 | 46.67,59.37 IC4.10 | IC5.7 60.48,57.15 61.75,58.42 U$27.P$1 61.75,58.58 60.64,59.69 59.37,59.69 | 59.37,59.69 IC5.5 | v59.37,59.85 59.37,59.69 | v59.37,64.77 IC5.1 | v74.45,5.87 72.87,5.87 IC3.14 | v76.52,7.94 79.69,7.94 U$19.L2 79.85,7.94 81.28,7.94 U$19.L1 81.44,7.94 82.71,7.94 U$19.L0 83.03,7.94 v84.61,7.94 | 77.31,14.61 78.11,14.61 78.74,13.97 C7.2 | 77.31,14.61 C8.2 | 71.12,12.38 72.71,12.38 IC3.4 72.87,12.38 v75.25,12.38 | 71.12,12.38 66.99,12.38 IC3.25 | v77.31,14.45 77.31,14.61 | IC1.10 51.91,8.57 52.86,8.57 53.18,8.26 54.61,8.26 C1.1 54.77,8.26 v62.87,8.26 | 71.12,11.75 70.48,11.11 66.99,11.11 IC3.23 66.83,11.11 v65.72,11.11 | 71.12,11.75 72.71,11.75 IC3.5 | 71.12,11.75 71.12,12.38 | B7.P$4 37.47,40.64 37.62,40.48 39.37,40.48 39.53,40.64 B8ALT.P$4 | v17.94,49.21 16.83,49.21 C22.2 | B5.P$4 13.34,48.26 13.81,47.78 15.72,47.78 16.19,47.31 17.46,47.31 SSW1.3 | B8.P$4 50.32,40.64 50.48,40.48 53.82,40.48 53.98,40.64 B9ALT.P$4 56.2,40.8 56.2,43.18 C13.2 | v8.89,35.56 C5.2 | v33.5,5.87 32.23,5.87 IC2.14 | C2.2 v34.29,11.43 | v27.94,11.11 27.3,11.11 | 27.3,11.11 26.35,11.11 IC2.23 | v63.98,35.56 C6.2 | B1.P$4 14.61,26.67 14.76,26.83 17.94,26.83 18.1,26.67 B1ALT.P$4 21.43,26.67 21.59,26.83 23.34,26.83 23.5,26.67 B2.P$4 29.05,26.67 29.21,26.83 30.96,26.83 31.11,26.67 B2ALT.P$4 36.67,26.67 36.83,26.83 38.58,26.83 38.73,26.67 B3.P$4 44.29,26.67 44.45,26.83 46.2,26.83 46.35,26.67 B3ALT.P$4 51.91,26.67 52.07,26.83 53.82,26.83 53.98,26.67 B4.P$4 59.53,26.67 59.69,26.83 61.44,26.83 61.59,26.67 63.82,26.67
  Bottom 0.406: 63.82,26.67 B4ALT.P$4 67.15,26.67 67.31,26.83 69.06,26.83 69.22,26.67 B10.P$4 74.77,26.67 74.93,26.83 76.68,26.83 76.83,26.67 B10ALT.P$4 82.39,26.67 82.55,26.83 84.3,26.83 84.45,26.67 B11.P$4 90.01,26.67 90.17,26.83 91.92,26.83 92.08,26.67 B11ALT.P$4 | 27.3,11.11 27.3,12.06 26.99,12.38 26.35,12.38 IC2.25 | C4.2 32.07,69.85 32.07,65.56 31.27,64.77 SERIAL.1 | 63.82,26.67 63.82,24.13 C3.2
  pour Top: 0,0 99.06,0 99.06,74.93 0,74.93
  pour Bottom: 0,0 99.06,0 99.06,74.93 0,74.93
GPA0  (via drill 0.41)
  Top 0.203: v53.34,16.35 v46.83,9.84 | v54.61,19.53 54.61,27.78 53.18,29.21 53.18,29.53 45.72,36.99 43.02,36.99 40.01,40.01 40.01,47.15 41.12,48.26 B8ALT.P$5
  Bottom 0.203: v46.83,9.84 44.77,9.84 IC1.21 | v53.34,16.35 53.34,19.05 54.13,19.05 v54.61,19.53 | B8.P$5 48.74,48.26 47.47,49.53 42.55,49.53 41.27,48.26 B8ALT.P$5
GPA1  (via drill 0.41)
  Top 0.203: v44.93,21.59 44.93,21.91 40.48,26.35 40.48,35.56 36.83,39.21 v36.83,47.78
  Bottom 0.203: v44.93,21.59 51.44,21.59 51.44,18.41 50.96,17.94 50.96,15.24 46.2,10.48 44.77,10.48 IC1.22 | v36.83,47.78 36.35,48.26 B7.P$5
GPA2  (via drill 0.41)
  Top 0.203: v47.31,12.86 47.31,14.29 51.44,18.41 v51.44,27.62 | v34.13,31.75 27.46,38.42 27.46,40.64 B6.P$5
  Bottom 0.203: v47.31,12.86 45.72,11.27 44.77,11.27 IC1.23 | v51.44,27.62 47.94,31.11 34.77,31.11 v34.13,31.75
GPA3  (via drill 0.41)
  Top 0.203: v47.15,15.24 48.1,16.19 48.1,17.46 46.99,18.57 46.99,26.83 v45.56,28.26
  Bottom 0.203: v47.15,15.24 42.39,15.24 42.39,13.02 43.5,11.91 44.61,11.91 IC1.24 | v45.56,28.26 45.56,30.64 20,30.64 12.22,38.42 12.22,40.64 B5.P$5
GPA4  (via drill 0.41)
  Top 0.203: v46.04,12.54 46.04,16.03 45.56,16.51 45.56,17.94 v41.91,21.59
  Bottom 0.203: v46.04,12.54 44.77,12.54 IC1.25 | v41.91,21.59 22.38,21.59 19.84,19.05 B1ALT.P$5 B1.P$5
GPA4S
  Top 0.203: 3.17,49.21 3.17,47.62 SSW1.2
  Bottom 0.203: IC4.25 39.53,63.34 38.1,63.34 38.1,67.15 33.5,71.75 20.8,71.75 3.17,54.13 3.17,47.62 SSW1.2
GPA5  (via drill 0.41)
  Top 0.203: v43.18,13.18 43.18,16.19 v40.32,19.05
  Bottom 0.203: v43.18,13.18 44.61,13.18 IC1.26 | v40.32,19.05 B2ALT.P$5 B2.P$5
GPA6
  Bottom 0.203: 50.16,19.05 50.16,15.08 48.74,13.65 44.77,13.65 IC1.27 | 50.16,19.05 B3.P$5 | 50.16,19.05 B3ALT.P$5
GPA7  (via drill 0.41)
  Top 0.203: v48.58,14.45 52.86,18.73 57.47,18.73 57.78,19.05 B4.P$5
  Bottom 0.203: v48.58,14.45 44.77,14.45 IC1.28 | B4.P$5 B4ALT.P$5
GPA12  (via drill 0.41)
  Top 0.203: v54.45,13.49 55.09,13.49 56.99,15.4 62.87,15.4 64.29,16.83 64.29,17.46 63.34,18.41 63.34,31.91 55.24,40.01 55.24,47.15 56.36,48.26 B9ALT.P$5
  Bottom 0.203: v54.45,13.49 52.86,11.91 51.91,11.91 IC1.5 | B9.P$5 63.98,48.26 62.71,49.53 57.78,49.53 56.52,48.26 B9ALT.P$5
GPA13
  Bottom 0.203: IC1.6 51.91,11.27 53.18,11.27 55.24,13.34 55.24,15.72 56.99,15.72 59.05,17.78 71.75,17.78 73.03,19.05 B10.P$5 B10ALT.P$5
GPA14  (via drill 0.41)
  Top 0.203: v59.37,10.64 64.93,5.08 80.33,5.08 85.57,10.32 85.57,15.56 88.27,18.26 88.27,19.05 B11.P$5 B11ALT.P$5
  Bottom 0.203: v59.37,10.64 53.98,10.64 53.82,10.48 51.91,10.48 IC1.7
GPB4  (via drill 0.41)
  Top 0.203: v10.79,46.83 10.79,56.2 20.64,66.04 34.29,66.04 34.45,65.88 v41.43,65.88
  Bottom 0.203: v41.43,65.88 44.61,62.71 46.67,62.71 IC4.5 | v10.79,46.83 15.24,42.39 15.4,42.39 SSW1.8
I2C_SCL  (via drill 0.41)
  Top 0.203: v53.34,6.83 51.12,4.6 32.7,4.6 26.67,10.64 26.67,11.43 v25.08,13.02 23.81,13.02 23.65,12.86 19.84,12.86 19.68,12.7 13.65,12.7 12.86,13.49 12.86,16.83 13.65,17.62 14.29,17.62 17.62,20.95 17.62,29.05 v25.24,36.67 | v25.24,49.85 27.78,52.39 30.96,52.39 35.08,56.52 35.08,60.17 33.81,61.44 33.81,62.07 SERIAL.4 | v24.13,67.63 33.81,67.63 v34.77,66.67
  Bottom 0.203: 35.08,62.07 35.08,57.94 37.15,55.88 41.59,55.88 43.66,57.94 46.67,57.94 IC4.12 | 35.08,62.07 33.81,62.07 SERIAL.4 | 53.02,7.14 v53.34,6.83 | 53.02,7.14 51.91,7.14 IC1.12 | 53.02,7.14 63.66,7.14 63.66,11.75 64.93,13.02 66.83,13.02 IC3.26 | v25.24,36.67 v25.24,49.85 | v25.08,13.02 26.19,13.02 IC2.26 | v24.13,67.63 24.38,67.63 | v34.77,66.67 34.77,65.56 35.08,65.25 35.08,62.07
  Bottom 0.254: U$21.P$4 24.38,67.63 24.38,67.56
I2C_SDA  (via drill 0.41)
  Top 0.203: v60.8,13.65 58.1,13.65 v50.48,6.03 49.53,5.08 32.86,5.08 27.15,10.79 27.15,11.43 27.46,11.75 v27.46,13.02 26.67,13.81 24.92,13.81 24.77,13.65 v23.5,13.65 | v26.04,33.34 26.04,20.8 23.02,17.78 23.02,15.72 v23.5,15.24
  Bottom 0.203: 30.8,54.93 34.92,54.93 35.56,54.29 41.75,54.29 44.77,57.31 46.67,57.31 IC4.13 | 30.8,54.93 29.37,56.36 29.37,61.75 | 29.37,61.75 29.37,62.07 31.11,62.07 SERIAL.3 | v27.46,13.02 26.83,13.65 26.35,13.65 IC2.27 | v50.48,6.03 50.96,6.51 51.75,6.51 IC1.13 | v60.8,13.65 66.83,13.65 IC3.27 | 30.8,54.93 27.94,52.07 27.94,49.53 26.83,49.53 26.04,48.74 v26.04,33.34 | v23.5,13.65 v23.5,15.24 | 29.37,61.75 24.92,66.2 24.92,69.85 U$21.P$3
L0
  Bottom 0.203: R20.1 11.43,17.3 9.53,17.3 7.78,19.05 7.14,19.05 6.35,19.84 6.35,25.4 B1.P$2 B1ALT.P$2
L1
  Bottom 0.203: R19.1 12.7,17.78 10.16,17.78 B1.P$3 B1ALT.P$3
L2  (via drill 0.41)
  Top 0.203: v17.78,18.26 17.78,19.21 21.59,23.02 21.59,24.13 B2.P$2
  Bottom 0.203: v17.78,18.26 R18.1 | B2.P$2 B2ALT.P$2
L3
  Bottom 0.203: R17.1 19.05,17.78 20.32,17.78 B2.P$3 B2ALT.P$3
L4  (via drill 0.41)
  Top 0.203: v38.1,16.99 38.1,18.57 36.83,19.84 36.83,24.13 B3.P$2
  Bottom 0.203: v38.1,16.99 R16.1 | B3.P$2 B3ALT.P$2
L5  (via drill 0.41)
  Top 0.203: v40.48,15.88 40.48,17.94 B3.P$3
  Bottom 0.203: v40.48,15.88 40.32,15.88 39.37,14.92 R15.1 | B3.P$3 B3ALT.P$3
L6  (via drill 0.41)
  Top 0.203: v58.42,16.19 58.42,17.78 59.69,19.05 59.69,24.13 B4ALT.P$2
  Bottom 0.203: v58.42,16.19 R14.1 | B4ALT.P$2 B4.P$2
L7  (via drill 0.41)
  Top 0.203: B4ALT.P$3 v60.96,16.19
  Bottom 0.203: v60.96,16.19 59.69,14.92 R13.1 | B4ALT.P$3 B4.P$3
L8
  Bottom 0.203: R12.1 7.62,40.64 8.1,40.64 8.89,41.43 8.89,46.99 B5.P$2
L9
  Bottom 0.203: R11.1 6.35,41.91 B5.P$3
L10
  Bottom 0.203: R10.1 24.13,46.99 B6.P$2
L11
  Bottom 0.203: B6.P$3 R9.1
L12
  Bottom 0.203: R8.1 36.83,39.37 33.02,39.37 32.38,40.01 32.38,41.91 B7.P$2
L13
  Bottom 0.203: B7.P$3 31.11,46.99 31.11,40.64 32.86,38.89 33.18,38.89 35.56,36.51 R7.1
L14
  Bottom 0.203: R6.1 49.53,39.37 48.26,39.37 46.99,40.64 | B8ALT.P$2 46.99,40.64 | B8.P$2 52.55,42.7 49.05,42.7 46.99,40.64
L15
  Bottom 0.203: R5.1 48.26,38.89 47.62,38.89 45.88,40.64 45.24,40.64 44.45,41.43 44.45,43.18 48.58,43.18 51.12,45.72 52.07,45.72 52.86,46.51 | B8ALT.P$3 49.85,46.99 50.64,47.78 51.59,47.78 52.86,46.51 | 52.86,46.51 B8.P$3
L16
  Top 0.203: B9ALT.P$2 B9.P$2
  Bottom 0.203: R32.1 55.88,39.37 56.99,39.37 59.53,41.91 B9ALT.P$2
L17  (via drill 0.41)
  Top 0.203: v59.69,41.12 59.69,45.72 B9ALT.P$3 B9.P$3
  Bottom 0.203: R31.1 57.15,38.89 57.47,38.89 v59.69,41.12
L18
  Bottom 0.203: 74.3,25.08 74.61,25.4 B10ALT.P$2 | 74.3,25.08 73.34,24.13 R30.1 | B10.P$2 68.9,25.08 74.3,25.08
L19
  Bottom 0.203: 74.61,20.32 73.34,21.59 R29.1 | B10ALT.P$3 74.61,20.32 | 74.61,20.32 B10.P$3
L20
  Bottom 0.203: B11.P$2 85.88,25.4 87.15,24.13 R28.1 90.17,24.13 B11ALT.P$2
L21
  Bottom 0.203: 89.53,20.64 89.85,20.32 B11ALT.P$3 | 89.53,20.64 88.58,21.59 R27.1 | B11.P$3 84.14,20.64 89.53,20.64
MOSI  (via drill 0.41)
  Top 0.203: v26.35,52.39 27.15,52.39 v29.69,54.93 30.48,55.72 32.38,55.72 33.66,56.99 SERIAL.8
  Bottom 0.203: v26.35,52.39 10.79,52.39 10.79,47.78 11.59,46.99 12.86,46.99 15.4,44.45 SSW1.6 | v29.69,54.93 22.38,62.23 U$21.P$8
N$1  (via drill 0.5)
  other vias: 27.56,5.97
N$3  (via drill 0.41)
  Top 0.203: v73.98,7.94 73.98,9.53 74.77,10.32 74.77,11.75 74.45,12.06 74.45,14.61 76.36,16.51 76.36,17.94 v78.26,19.84
  Bottom 0.203: v73.98,7.94 72.87,7.94 IC3.11 | v78.26,19.84 80.01,21.59 R27.2
N$4  (via drill 0.41)
  Top 0.203: v29.84,6.51 30.16,6.51 32.54,4.13 51.59,4.13 v59.37,11.91
  Bottom 0.203: v29.84,6.51 32.07,6.51 IC2.13 | v59.37,11.91 59.37,13.02 59.69,13.02 R13.2
N$5  (via drill 0.41)
  Top 0.203: v43.18,9.37 46.35,9.37 46.67,9.05 49.05,9.05 52.7,12.7 55.24,12.7 v56.04,13.49
  Bottom 0.203: v43.18,9.37 41.12,7.3 32.23,7.3 IC2.12 | v56.04,13.49 56.36,13.18 58.42,13.18 R14.2
N$6  (via drill 0.41)
  Top 0.203: v77.31,8.73 77.31,13.34 82.55,18.57 v82.55,23.65
  Bottom 0.203: v77.31,8.73 73.82,8.73 73.66,8.57 72.87,8.57 IC3.10 | v82.55,23.65 83.03,24.13 R28.2
N$7
  Bottom 0.203: R15.2 39.37,12.06 35.08,7.78 32.23,7.78 IC2.11
N$8  (via drill 0.41)
  Top 0.203: v71.6,9.21 71.6,19.84 v70.33,21.11
  Bottom 0.203: v71.6,9.21 72.71,9.21 IC3.9 | v70.33,21.11 70.8,21.59 R29.2
N$9  (via drill 0.41)
  Top 0.203: v34.29,8.57 34.29,9.21 v37.15,12.06
  Bottom 0.203: v34.29,8.57 32.23,8.57 IC2.10 | v37.15,12.06 38.1,13.02 R16.2
N$10  (via drill 0.41)
  Top 0.203: v27.46,8.89 23.18,8.89 v20,12.06
  Bottom 0.203: v27.46,8.89 27.78,9.21 32.07,9.21 IC2.9 | v20,12.06 19.05,13.02 R17.2
N$11  (via drill 0.41)
  Top 0.203: v30.96,8.41 v30.96,10 | v28.1,8.1 22.54,8.1 v18.73,11.91
  Bottom 0.203: v30.96,10 31.91,10 32.07,9.84 IC2.8 | v30.96,8.41 30.64,8.1 v28.1,8.1 | v18.73,11.91 17.78,12.86 R18.2
N$12  (via drill 0.41)
  Top 0.203: v29.53,11.91 26.99,14.45 18.73,14.45 17.78,13.49 v13.81,13.49
  Bottom 0.203: v29.53,11.91 30,11.91 31.27,10.64 32.07,10.64 IC2.7 | v13.81,13.49 13.49,13.18 12.7,13.18 R19.2
N$13  (via drill 0.41)
  Top 0.203: v70.64,10.32 70.64,14.29 68.42,16.51 68.42,18.73 66.99,20.16 v66.99,23.65
  Bottom 0.203: v70.64,10.32 70.96,10 72.55,10 72.71,9.84 IC3.8 | v66.99,23.65 67.47,24.13 R30.2
N$14  (via drill 0.41)
  Top 0.203: v73.98,10.48 73.98,14.45 v73.18,15.24 | v63.5,16.99 63.5,17.62 62.23,18.89 62.23,27.78 60.8,29.21 v60.8,31.27
  Bottom 0.203: v73.98,10.48 72.87,10.48 IC3.7 | v73.18,15.24 73.03,15.4 65.09,15.4 v63.5,16.99 | v60.8,31.27 57.47,34.61 57.15,34.61 R31.2
N$15  (via drill 0.41)
  Top 0.203: v75.09,9.53 75.09,8.1 74.14,7.14 73.82,7.14 72.39,8.57 72.39,16.51 74.3,18.41 v74.3,27.62
  Bottom 0.203: v75.09,9.53 75.09,10.32 74.14,11.27 73.03,11.27 72.87,11.11 IC3.6 | v74.3,27.62 71.44,30.48 59.85,30.48 55.88,34.45 R32.2
N$19  (via drill 0.41)
  Top 0.203: v35.24,6.51 v35.24,8.89
  Bottom 0.203: v35.24,8.89 33.18,10.95 32.38,10.95 32.23,11.11 IC2.6 | v35.24,6.51 33.81,5.08 18.57,5.08 11.43,12.22 R20.2
N$20  (via drill 0.41)
  Top 0.203: v19.84,5.87 12.38,13.34 12.38,17.46 13.97,19.05 13.97,27.46 v14.13,27.62
  Bottom 0.203: v19.84,5.87 26.19,5.87 IC2.15 | v14.13,27.62 7.62,34.13 R12.2
N$21  (via drill 0.41)
  Top 0.203: v9.37,15.24 v17.94,6.67
  Bottom 0.203: v17.94,6.67 26.19,6.67 IC2.16 | v9.37,15.24 9.21,15.4 8.57,15.4 5.87,18.1 5.87,34.61 6.35,34.61 R11.2
N$22  (via drill 0.41)
  Top 0.203: v14.61,14.29 17.94,14.29 22.7,19.05 23.34,19.05 25.24,20.95 v25.24,33.97
  Bottom 0.203: v14.61,14.29 14.61,13.49 20.8,7.3 26.19,7.3 IC2.17 | v25.24,33.97 24.61,34.61 24.13,34.61 R10.2
N$23  (via drill 0.41)
  Top 0.203: v16.19,17.94 16.19,18.26 21.11,23.18 21.11,27.3 22.86,29.05 v22.86,33.34
  Bottom 0.203: v16.19,17.94 15.4,17.94 15.4,13.34 18.26,10.48 22.07,10.48 24.61,7.94 26.19,7.94 IC2.18 | R9.2 v22.86,33.34
N$24  (via drill 0.41)
  Top 0.203: v16.35,15.24 15.4,16.19 15.4,18.1 18.41,21.11 18.41,28.89 v22.07,32.54
  Bottom 0.203: v16.35,15.24 16.35,13.02 18.41,10.95 23.34,10.95 25.72,8.57 26.19,8.57 IC2.19 | v22.07,32.54 34.92,32.54 36.83,34.45 R8.2
N$25  (via drill 0.41)
  Top 0.203: v23.97,17.78 23.97,18.1 28.73,22.86 28.73,27.3 30.64,29.21 v30.64,33.34
  Bottom 0.203: v23.97,17.78 22.7,17.78 22.7,12.22 25.56,9.37 26.04,9.37 26.19,9.21 IC2.20 | v30.64,33.34 31.91,34.61 35.56,34.61 R7.2
N$26  (via drill 0.41)
  Top 0.203: v25.4,15.24 29.21,19.05 29.21,25.88 31.43,28.1 33.34,28.1 v37.15,31.91
  Bottom 0.203: v25.4,15.24 24.29,15.24 24.29,11.27 25.56,10 26.04,10 26.19,9.84 IC2.21 | v37.15,31.91 37.94,32.7 48.42,32.7 49.53,33.81 R6.2
N$27  (via drill 0.41)
  Top 0.203: v48.26,18.26 48.26,21.59 48.58,21.91 48.58,33.18 v48.26,33.5
  Bottom 0.203: v48.26,18.26 47.78,17.78 34.45,17.78 34.13,18.1 30.48,18.1 30.32,17.94 28.1,17.94 28.1,16.19 28.73,15.56 28.73,10.79 28.26,10.32 26.51,10.32 26.35,10.48 IC2.22 | R5.2 v48.26,33.5
N$33
  Bottom 0.203: C10.1 45.72,69.53 48.26,69.53 R33.1 48.26,69.37 52.23,65.41 52.7,65.41 52.86,65.25 52.86,64.14 | 52.86,64.14 52.86,63.5 IC5.13 | 52.86,64.14 58.9,64.14 59.05,63.98 60.17,63.98 60.17,61.91 59.69,61.44 59.05,61.44 58.9,61.59 56.52,61.59 52.7,57.78 50.01,57.78 41.91,49.69 33.18,49.69 32.7,49.21 29.69,49.21 29.69,45.72 SW1.B
SCLK  (via drill 0.41)
  Top 0.203: 30,56.99 v22.54,49.53 | 30,56.99 31.11,56.99 SERIAL.7 | 30,56.99 v28.57,58.42
  Bottom 0.203: v22.54,49.53 21.59,49.53 21.59,47.31 17.62,43.34 SSW1.7 | v28.57,58.42 22.86,64.14 22.86,69.85 U$21.P$7

### Text on the board
_tsilk: 1
_bsilk: PCB-E21-KP01, v03-16 / SKAARHOJ